# Altium schematic sheet Motor_1.SchDoc
size A4
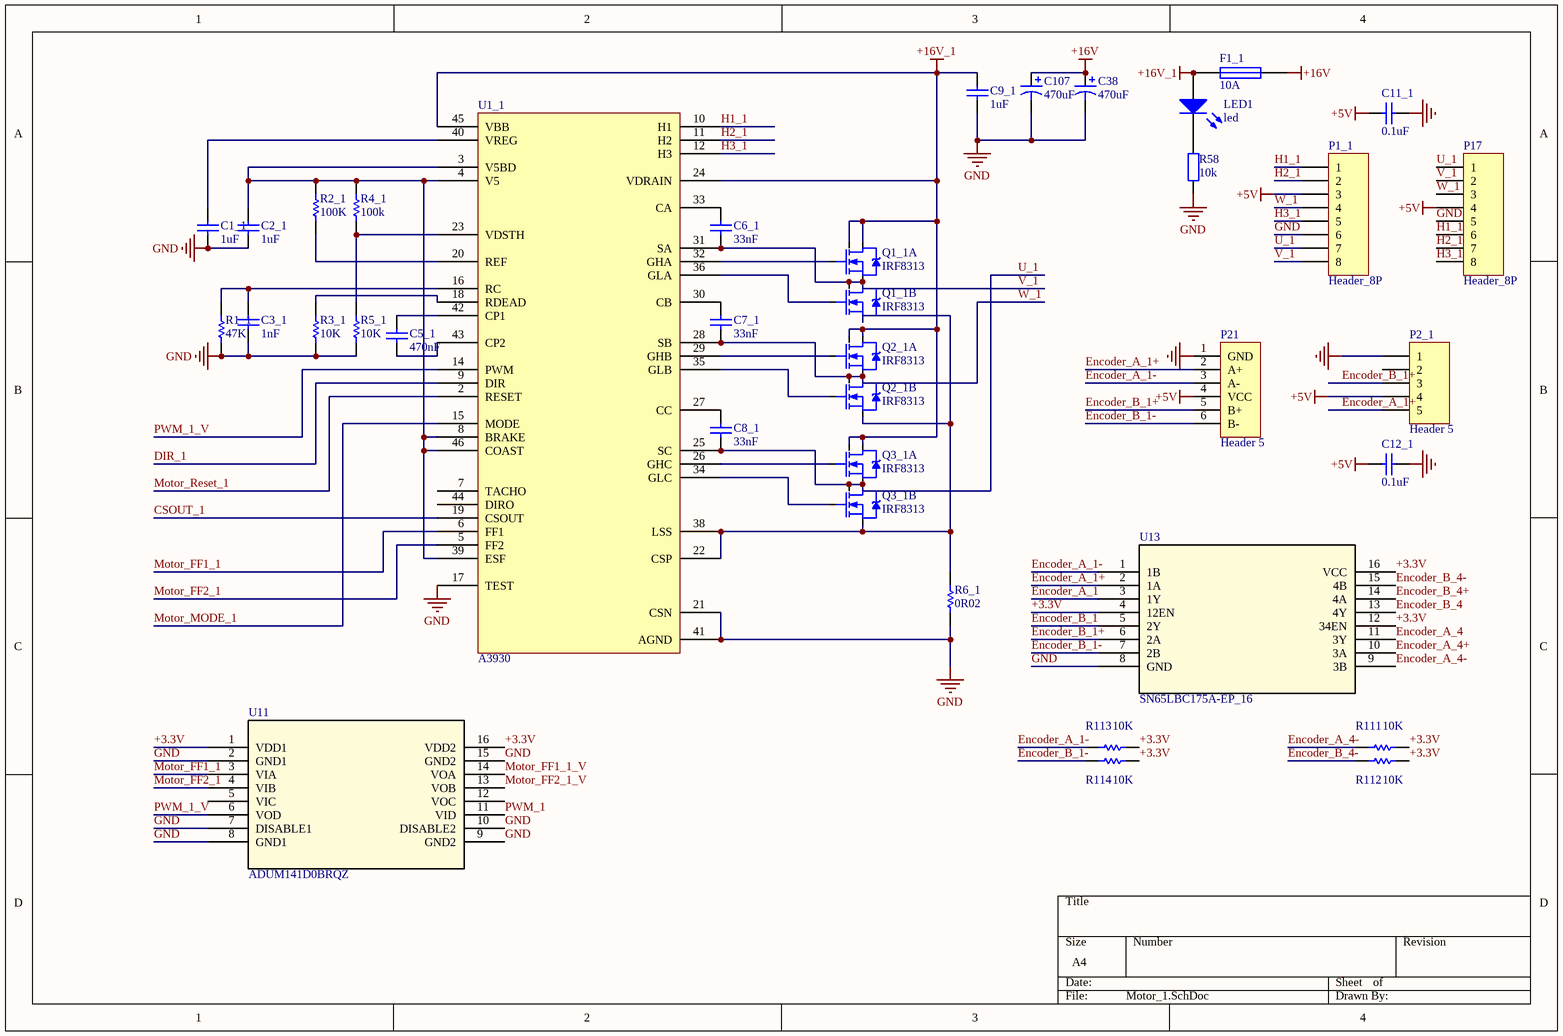
[diagram p0: Motor_1.SchDoc]

## Parts
C1_1  1uf  [0603C]
C2_1  1uf  [0603C]
C3_1  1nf  [0603C]
C5_1  470nf  [0603C]
C6_1  33nf  [0603C]
C7_1  33nf  [0603C]
C8_1  33nf  [0603C]
C9_1  1uf  [0603C]
C11_1  0.1uf  [0603C]
C12_1  0.1uf  [0603C]
C38  470uF  [470uF]
C107  470uF  [470uF]
F1_1  10A  [FUSE_HEADER]
LED1  led  [0603_diode]
P1_1  Header_8P  [8P - WF25122]
P2_1  Header 5  [SHDR5]
P17  Header_8P  [SHDR8]
P21  Header 5  [SHDR6]
Q1_1  IRF8313  [so-8 bg]  (parts A,B of 2)
Q2_1  IRF8313  [so-8 bg]  (parts A,B of 2)
Q3_1  IRF8313  [so-8 bg]  (parts A,B of 2)
R1_1  47k  [0603R]
R2_1  100k  [0603R]
R3_1  10k  [0603R]
R4_1  100k  [0603R]
R5_1  10k  [0603R]
R6_1  value 0R02  [1206 10A]  (hidden comment: 0.02)
R58  10k  [0603]
R111  10k  [0603R]
R112  10k  [0603R]
R113  10k  [0603R]
R114  10k  [0603R]
U1_1  A3930  [LQFP-48]
U11  ADUM141D0BRQZ  [RQ_16]
U13  SN65LBC175A-EP_16  [SOP16]

## Nets
+5V: C11_1.2 C12_1.2 P1_1.3 P2_1.4 P17.4 P21.4(VCC)
+16V: C38.1 C107.1 F1_1.1
+16V_1: C9_1.2 F1_1.2 LED1.1(A) Q1_1.7(D2) Q1_1.8(D2) Q2_1.7(D2) Q2_1.8(D2) Q3_1.7(D2) Q3_1.8(D2) U1_1.24(VDRAIN) U1_1.45(VBB)
GND: C1_1.1 C2_1.1 C3_1.1 C9_1.1 C11_1.1 C12_1.1 C38.2 C107.2 P1_1.6 P2_1.1 P17.5 P21.1(GND) R1_1.1 R3_1.1 R5_1.1 R6_1.1 R58.1 U1_1.17(TEST) U1_1.21(CSN) U1_1.41(AGND) U11.2(GND1) U11.7(DISABLE1) U11.8(GND1) U11.9(GND2) U11.10(DISABLE2) U11.15(GND2) U13.8(GND)
+3.3V: R111.1 R112.1 R113.1 R114.1 U11.1(VDD1) U11.16(VDD2) U13.4(12EN) U13.12(34EN) U13.16(VCC)
CSOUT_1: U1_1.19(CSOUT)
DIR_1: U1_1.9(DIR)
Encoder_A_1: U13.3(1Y)
Encoder_A_1+: P2_1.5 P21.2(A+) U13.2(1A)
Encoder_A_1-: P21.3(A-) R113.2 U13.1(1B)
Encoder_A_4: U13.11(3Y)
Encoder_A_4+: U13.10(3A)
Encoder_A_4-: R111.2 U13.9(3B)
Encoder_B_1: U13.5(2Y)
Encoder_B_1+: P2_1.3 P21.5(B+) U13.6(2A)
Encoder_B_1-: P21.6(B-) R114.2 U13.7(2B)
Encoder_B_4: U13.13(4Y)
Encoder_B_4+: U13.14(4A)
Encoder_B_4-: R112.2 U13.15(4B)
H1_1: P1_1.1 P17.6 U1_1.10(H1)
H2_1: P1_1.2 P17.7 U1_1.11(H2)
H3_1: P1_1.5 P17.8 U1_1.12(H3)
Motor_FF1_1: U1_1.6(FF1) U11.3(VIA)
Motor_FF1_1_V: U11.14(VOA)
Motor_FF2_1: U1_1.5(FF2) U11.4(VIB)
Motor_FF2_1_V: U11.13(VOB)
Motor_MODE_1: U1_1.15(MODE)
Motor_Reset_1: U1_1.2(RESET)
PWM_1: U11.11(VID)
PWM_1_V: U1_1.14(PWM) U11.6(VOD)
U_1: C8_1.1 P1_1.7 P17.1 Q3_1.1(S2) Q3_1.5(D1) Q3_1.6(D1) U1_1.25(SC)
V_1: C6_1.1 P1_1.8 P17.2 Q1_1.1(S2) Q1_1.5(D1) Q1_1.6(D1) U1_1.31(SA)
W_1: C7_1.1 P1_1.4 P17.3 Q2_1.1(S2) Q2_1.5(D1) Q2_1.6(D1) U1_1.28(SB)
NetC1_1_2: C1_1.2 U1_1.40(VREG)
NetC2_1_2: C2_1.2 R2_1.2 R4_1.2 U1_1.3(V5BD) U1_1.4(V5) U1_1.8(BRAKE) U1_1.39(ESF) U1_1.46(COAST)
NetC3_1_2: C3_1.2 R1_1.2 U1_1.16(RC)
NetC5_1_1: C5_1.1 U1_1.43(CP2)
NetC5_1_2: C5_1.2 U1_1.42(CP1)
NetC6_1_2: C6_1.2 U1_1.33(CA)
NetC7_1_2: C7_1.2 U1_1.30(CB)
NetC8_1_2: C8_1.2 U1_1.27(CC)
NetLED1_2: LED1.2(K) R58.2
NetQ1_1_2: Q1_1.2(G2) U1_1.32(GHA)
NetQ1_1_3: Q1_1.3(S1) Q2_1.3(S1) Q3_1.3(S1) R6_1.2 U1_1.22(CSP) U1_1.38(LSS)
NetQ1_1_4: Q1_1.4(G1) U1_1.36(GLA)
NetQ2_1_2: Q2_1.2(G2) U1_1.29(GHB)
NetQ2_1_4: Q2_1.4(G1) U1_1.35(GLB)
NetQ3_1_2: Q3_1.2(G2) U1_1.26(GHC)
NetQ3_1_4: Q3_1.4(G1) U1_1.34(GLC)
NetR2_1_1: R2_1.1 U1_1.20(REF)
NetR3_1_2: R3_1.2 U1_1.18(RDEAD)
NetR4_1_1: R4_1.1 R5_1.2 U1_1.23(VDSTH)

Not connected (* = marked no-connect by the designer): P2_1 2; U1_1 7(TACHO) 44(DIRO); U11 5(VIC) 12(VOC)

## Library data of the parts
C1_1 C2_1 C3_1 C5_1 C6_1 C7_1 C8_1 C9_1 C11_1 C12_1 = Cap: Capacitor; Manufacturer: Generic Components; Class: Passive; Published: 08/06/2000; Publisher: Altium Hobart Technology Centre; SubClass: Capacitor
  C1_1 C2_1 C9_1: Value: 1uF
  C3_1: Value: 1nF
  C5_1: Value: 470nF
  C6_1 C7_1 C8_1: Value: 33nF
  C11_1 C12_1: Value: 0.1uF
C38 C107 = Cap Pol1: Polarized Capacitor (Radial); Published: 8-Jun-2000; LatestRevisionDate: 17-Jul-2002; LatestRevisionNote: Re-released for DXP Platform.; PackageReference: RB7.6-15; Publisher: Altium Limited; PackageDescription: Polarized Capacitor (Radial); 2 Leads
F1_1 = FUSE
P1_1 P17 = Header_8P: Used for Motor connection in ZJUNlict
P2_1 = Header 5: Header, 5-Pin; LatestRevisionDate: 17-Jul-2002; LatestRevisionNote: Re-released for DXP Platform.; Publisher: Altium Limited
P21 = Header 6: Header, 5-Pin; LatestRevisionDate: 17-Jul-2002; LatestRevisionNote: Re-released for DXP Platform.; Publisher: Altium Limited
Q1_1 Q2_1 Q3_1 = SO-8 IRF8313
R1_1 R2_1 R3_1 R4_1 R5_1 R6_1 R111-R114 = Res1: Resistor; Manufacturer: Generic Components; Class: Passive; Published: 08/06/2000; Publisher: Altium Hobart Technology Centre; SubClass: Resistor
  R1_1: Value: 47K
  R2_1: Value: 100K
  R3_1 R5_1 R111-R114: Value: 10K
  R4_1: Value: 100k
R58 = res
U1_1 = LQFP 48
U11 = ADUM141D0BRQZ: Imported; RefDes: RefDes; Type: DEV; Value: Value
U13 = SN65LBC175A-EP_16: Quadruple 2-Input Positive-NAND Gates; Manufacturer: Texas Instruments; GENERIC_PART_NUMBER: 74AC11000; INDUSTRY_STD_PKG_TYPE: SOIC; PIN_COUNT: 16; PACKAGE_DESIGNATOR: D; Datasheet_URL: http://www.ti.com/lit/gpn/74AC11000; FAMILY_NAME: NAND GATE; RefDes: RefDes; Type: DEV; Value: Value